# Altium schematic sheet main.SchDoc
size 297 x 209 mm; ProjectSection: Set ProjectSection in Document Parameters; PageSetup: Record=PageOptions|CenterHorizontal=True|CenterVertical=True|PrintScale=1.00|XCorrection=1.00|YCorrection=1.00|PrintKind=1|BorderSize=5000000|LeftOffset=0|BottomOffset=0|Orientation=2|PaperLength=1000|PaperWidth=1000|Scale=100|PaperSource=7|PrintQuality=1200|MediaType=1|DitherType=10|PaperKind=A4|PrintScaleMode=1
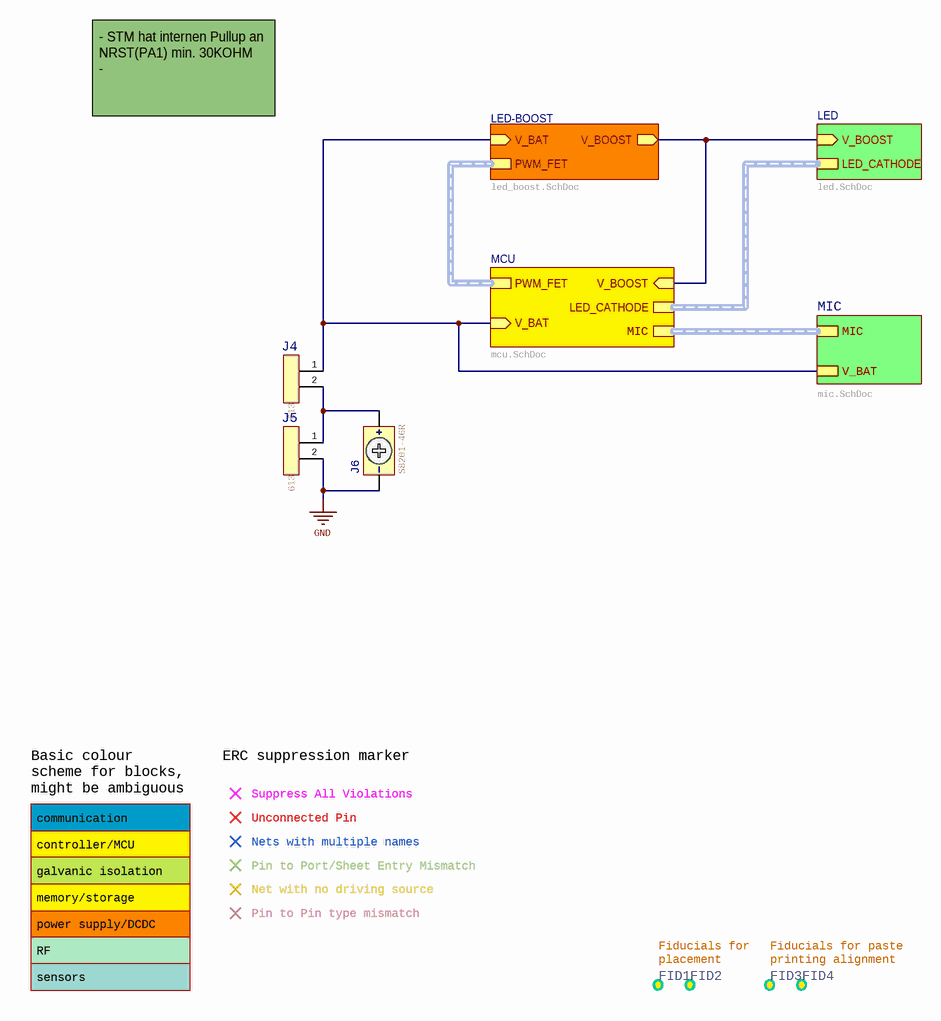
[diagram p0: main.SchDoc]

## Parts
FID1  FIDUCIAL  [FID-1MM-0.5MM]  (value not drawn)  (no BOM)
FID2  FIDUCIAL  [FID-1MM-0.5MM]  (value not drawn)  (no BOM)
FID3  FIDUCIAL-CIRCLE-PASTE  [FID-1MM-0.5MM-PASTE]  (value not drawn)  (no BOM)
FID4  FIDUCIAL-CIRCLE-PASTE  [FID-1MM-0.5MM-PASTE]  (value not drawn)  (no BOM)
J4  Manufacturer P/N: 61300211121  [CON-02-1-254-V-T-PFL-Jumper]  (hidden comment: CON-02)
J5  Manufacturer P/N: 61300211121  [CON-02-1-254-V-T-PFL-Jumper]  (hidden comment: CON-02)
J6  Manufacturer P/N: S8201-46R  [BAT-CR1225-SMD-HARWIN]  (hidden comment: BAT-COIN)

## Sub-sheets
LED = led.SchDoc: V_BOOST (in), LED_CATHODE (harness LED_CATHODE)
LED-BOOST = led_boost.SchDoc: PWM_FET (harness PWM_FET), V_BAT (in), V_BOOST (out)
MCU = mcu.SchDoc: V_BAT (in), LED_CATHODE (harness LED_CATHODE), PWM_FET (harness PWM_FET), V_BOOST (in), MIC (harness MIC)
MIC = mic.SchDoc: MIC (harness MIC), V_BAT

## Nets
GND: J5.2 J6.2(-)
NetJ4_1: J4.1 ; sheet MCU/V_BAT, sheet LED-BOOST/V_BAT, sheet MIC/V_BAT
NetJ4_2: J4.2 J5.1 J6.1(+)
(unnamed): sheet MCU/V_BOOST, sheet LED/V_BOOST, sheet LED-BOOST/V_BOOST

## Buses and harness runs
harness sheet LED-BOOST/PWM_FET = sheet MCU/PWM_FET
harness sheet LED/LED_CATHODE = sheet MCU/LED_CATHODE
harness sheet MCU/MIC = sheet MIC/MIC

## Notes on the sheet
- - STM hat internen Pullup an NRST(PA1) min. 30KOHM
  -
- Suppress All Violations
- communication
- controller/MCU
- Unconnected Pin
- Nets with multiple names
- Pin to Port/Sheet Entry Mismatch
- power supply/DCDC
- memory/storage
- galvanic isolation
- Net with no driving source
- Pin to Pin type mismatch
- Basic colour scheme for blocks, might be ambiguous
- RF
- sensors
- ERC suppression marker
- Fiducials for
  placement
- Fiducials for paste
  printing alignment
- PCB production parameters
- # of layers:
- material:
- copper thickness (µm)
- outer layers:
- hole parameters (µm)
- final pcb thickness (mm):
- min finished hole size:
- separation method:
- surface finish:
- min track width outer layers (µm):
- min track width inner layers (µm):
- Project
- inner layers:
- Customer
- min outer annular ring:
- min inner annular ring:
- isolation distance outer layers (µm):
- isolation distance inner layers (µm):
- File Name
- Part
- Section
- Revision (File)
- Variant
- Revision (Project)
- Date
- Sheet
- Contronix GmbH <https://contronix.de>
- Nizzastr. 6, 01445 Radebeul

## Library data of the parts
FID1 FID2 = FID-1MM-0.5MM: Fiducial Mark, 1mm diameter, 0.5mm clearance; hasAltManufacturer: 0; Contronix P/N: W2HGX5; Design Item Id: FID-1MM-0.5MM; Created: 28.03.2011 09:53:08; Modified: 14.03.2013 14:16:18; Obsolete: 0
FID3 FID4 = FID-1MM-0.5MM-CIRCLE-PASTE: Fiducial Mark, 1mm circle0.5mm clearance, Pastemask open; hasAltManufacturer: 0; Contronix P/N: M7DEYG; Design Item Id: FID-1MM-0.5MM-CIRCLE-PASTE; Created: 27.10.2017 07:53:13; Modified: 27.10.2017 07:53:13; Obsolete: 0
J4 J5 = CON-02-1-254-V-T-PFL-Jumper: Stiftleiste, 2-polig, 2.54mm, +Jumper; Manufacturer: Würth Elektronik; hasAltManufacturer: 0; Contronix P/N: JT919C; NumberOfPins: 2; NumberOfRows: 1; Pitch: 2,54; Rev: =VersionControl_RevNumber; Design Item Id: CON-02-1-254-V-T-PFL-Jumper; Manufacturer Part Number: 61300211121; Stock: 0; Price: 0,05; Price (€): 0,05; autIdem: 0; A I: 0; ComponentLink1Description: Manufacturer Datasheet; ComponentLink1URL: http://www.molex.com/datasheets/pdf/0879140216_PCB_HEADERS.pdf; Supplier 1: Digi-Key; Supplier Part Number 1: 732-5315-ND; Supplier 2: Mouser; Supplier Part Number 2: 710-61300211121; Modified: 25.07.2019 11:36:41; Obsolete: 0; MountingType: THT
J6 = BAT-CR1225-SMD-HARWIN: CR1216 1225 Battery Holder SMT; Manufacturer: Harwin; hasAltManufacturer: 0; Contronix P/N: JWVM9H; NumberOfPins: 2; NumberOfRows: 1; Rev: =VersionControl_RevNumber; Design Item Id: BAT-CR1225-SMD-HARWIN; Price: 0,57; Price (€): 0,57; ComponentLink1Description: Manufacturer Drawing; ComponentLink1URL: https://cdn.harwin.com/pdfs/S8201R.pdf; Supplier 1: Digi-Key; Supplier Part Number 1: 952-1662-1-ND; Supplier 2: Mouser; Supplier Part Number 2: 855-S8201-46R; Created: 21.09.2020 18:54:32; Modified: 21.09.2020 18:54:32; Obsolete: 0; Type: Battery Holder; MountingType: SMT; Manufacturer Part Number: S8201-46R